# Altium schematic sheet FPGA_Project1.SchDoc
size A4
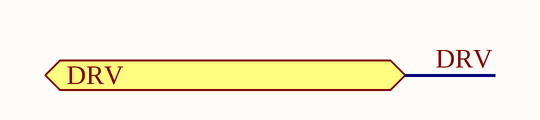
[diagram p0: FPGA_Project1.SchDoc]

## Ports
DRV (bidir)

## Nets
DRV: port DRV